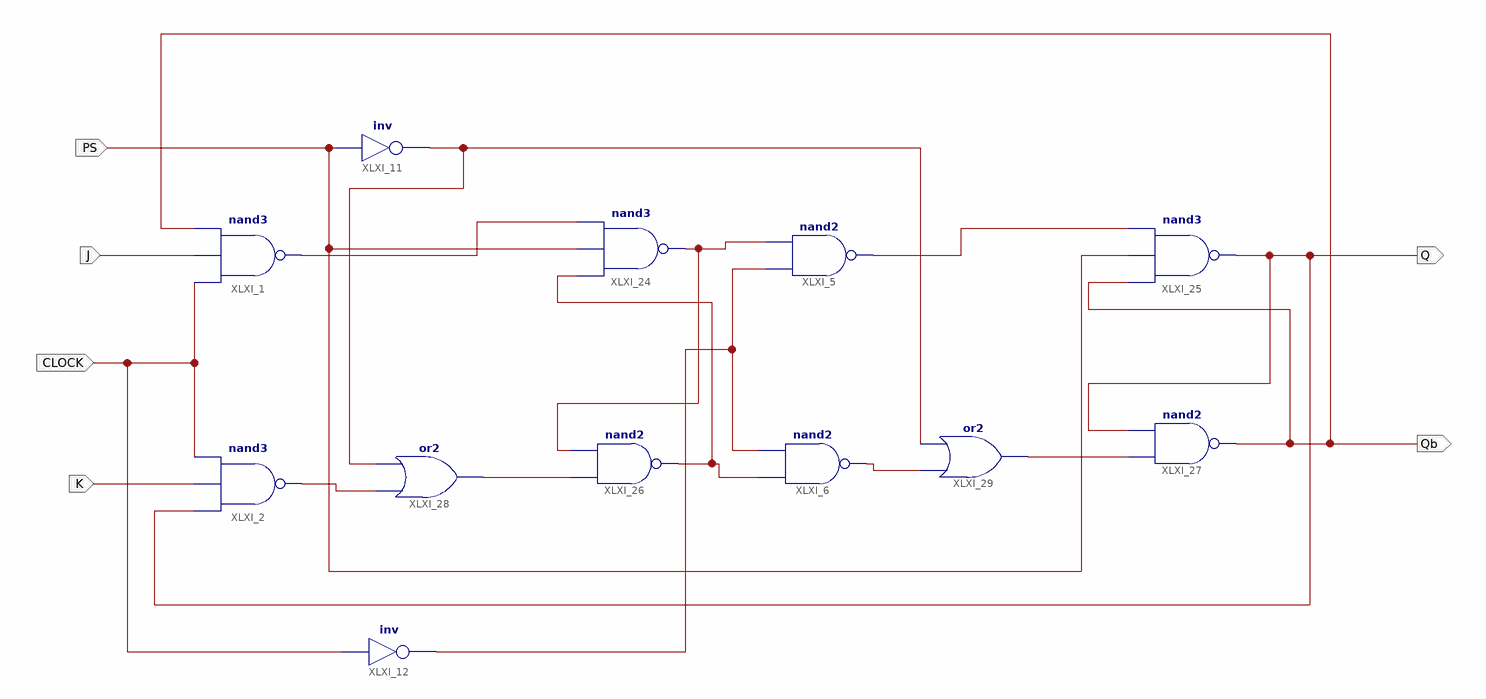
[diagram p0: schematic sheet 1]
// Xilinx ISE schematic Master_Slave_1_0.sch (artix7) as structural Verilog: 12 symbols, 6 ports
module Master_Slave_1_0 (
  input  J,
  input  PS,
  input  K,
  input  CLOCK,
  output Q,
  output Qb
);

  wire XLXN_53, XLXN_56, XLXN_57, XLXN_58, XLXN_67, XLXN_72, XLXN_73, XLXN_75, XLXN_76, XLXN_77;

  nand XLXI_1 (XLXN_67, CLOCK, J, Qb);
  nand XLXI_2 (XLXN_72, Q, K, CLOCK);
  nand XLXI_5 (XLXN_77, XLXN_57, XLXN_56);
  nand XLXI_6 (XLXN_76, XLXN_58, XLXN_57);
  not XLXI_11 (XLXN_53, PS);
  not XLXI_12 (XLXN_57, CLOCK);
  nand XLXI_24 (XLXN_56, XLXN_58, PS, XLXN_67);
  nand XLXI_25 (Q, Qb, PS, XLXN_77);
  nand XLXI_26 (XLXN_58, XLXN_73, XLXN_56);
  nand XLXI_27 (Qb, XLXN_75, Q);
  or XLXI_28 (XLXN_73, XLXN_72, XLXN_53);
  or XLXI_29 (XLXN_75, XLXN_76, XLXN_53);
endmodule
